# Altium schematic sheet 03 POWER.SchDoc
size 513 x 386 mm
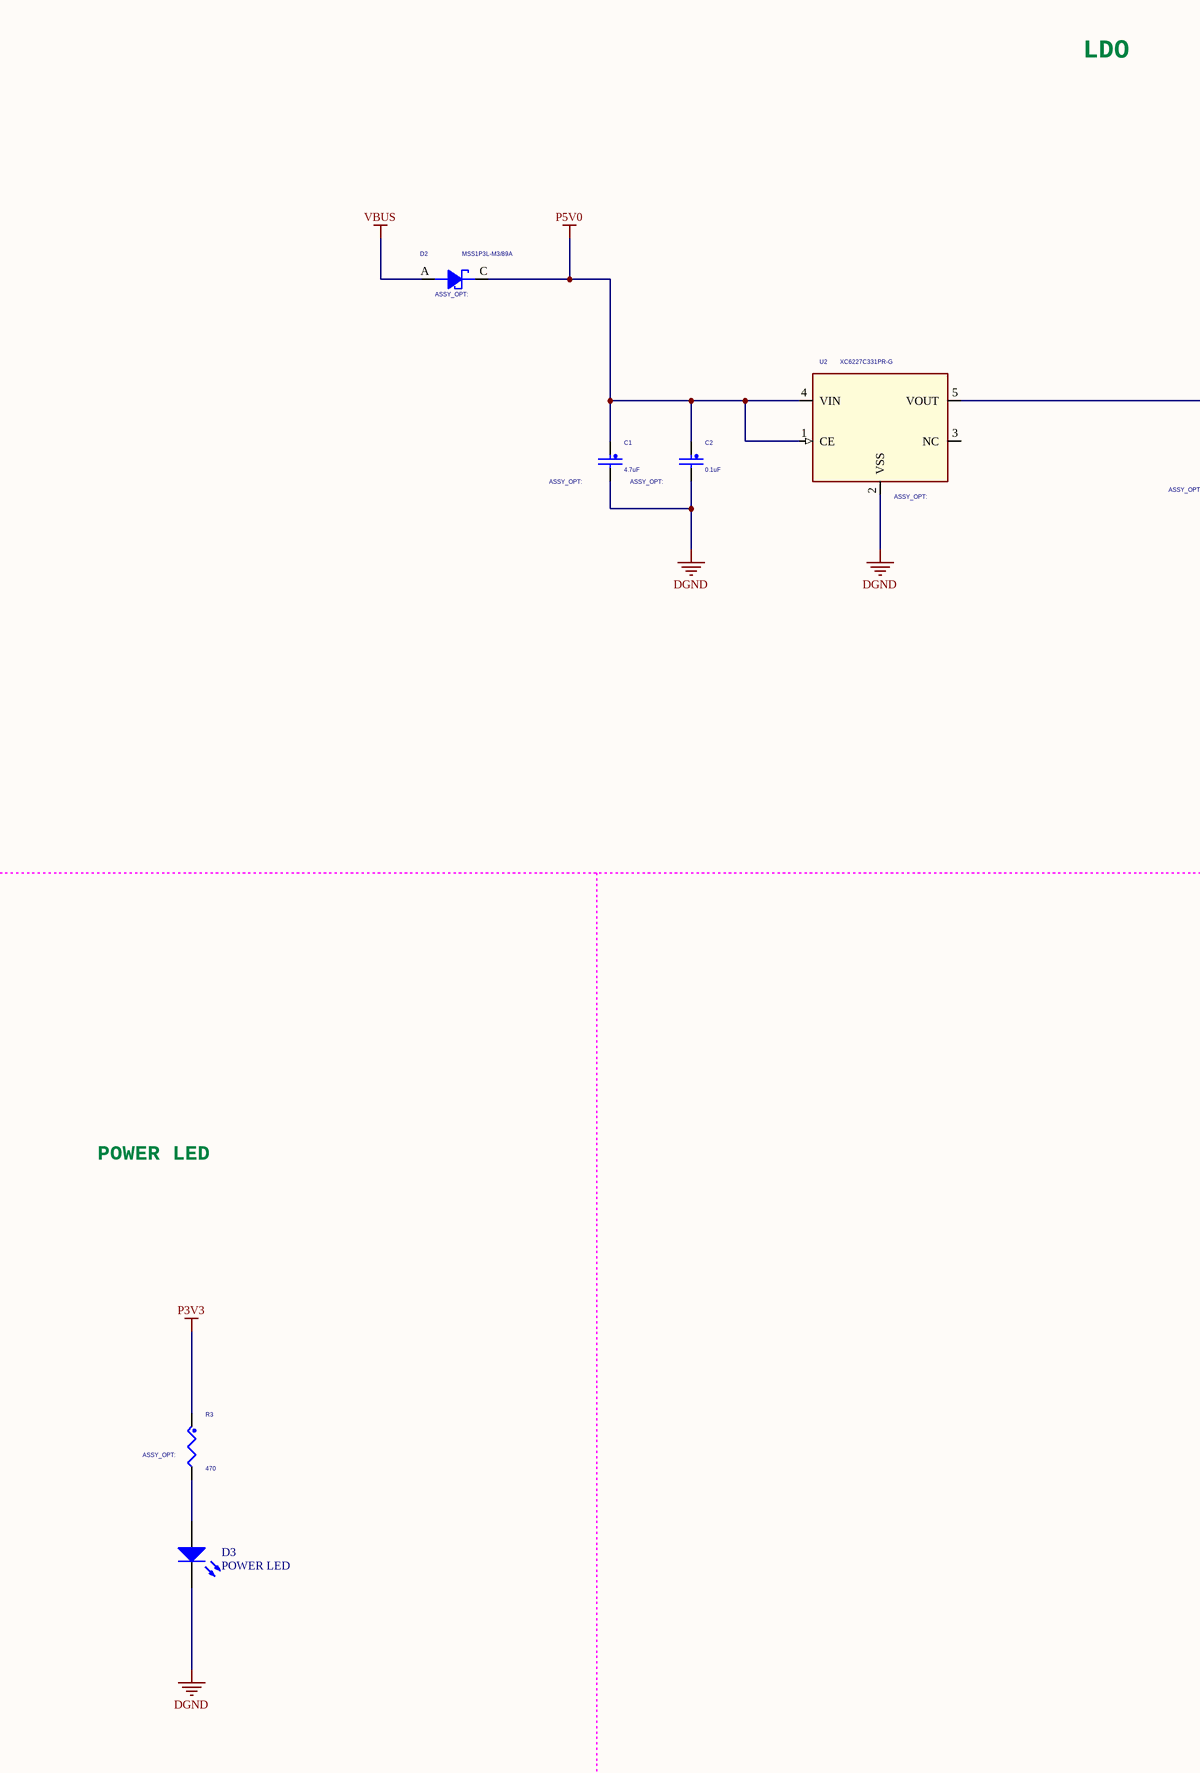
[diagram p0: 03 POWER.SchDoc, left]
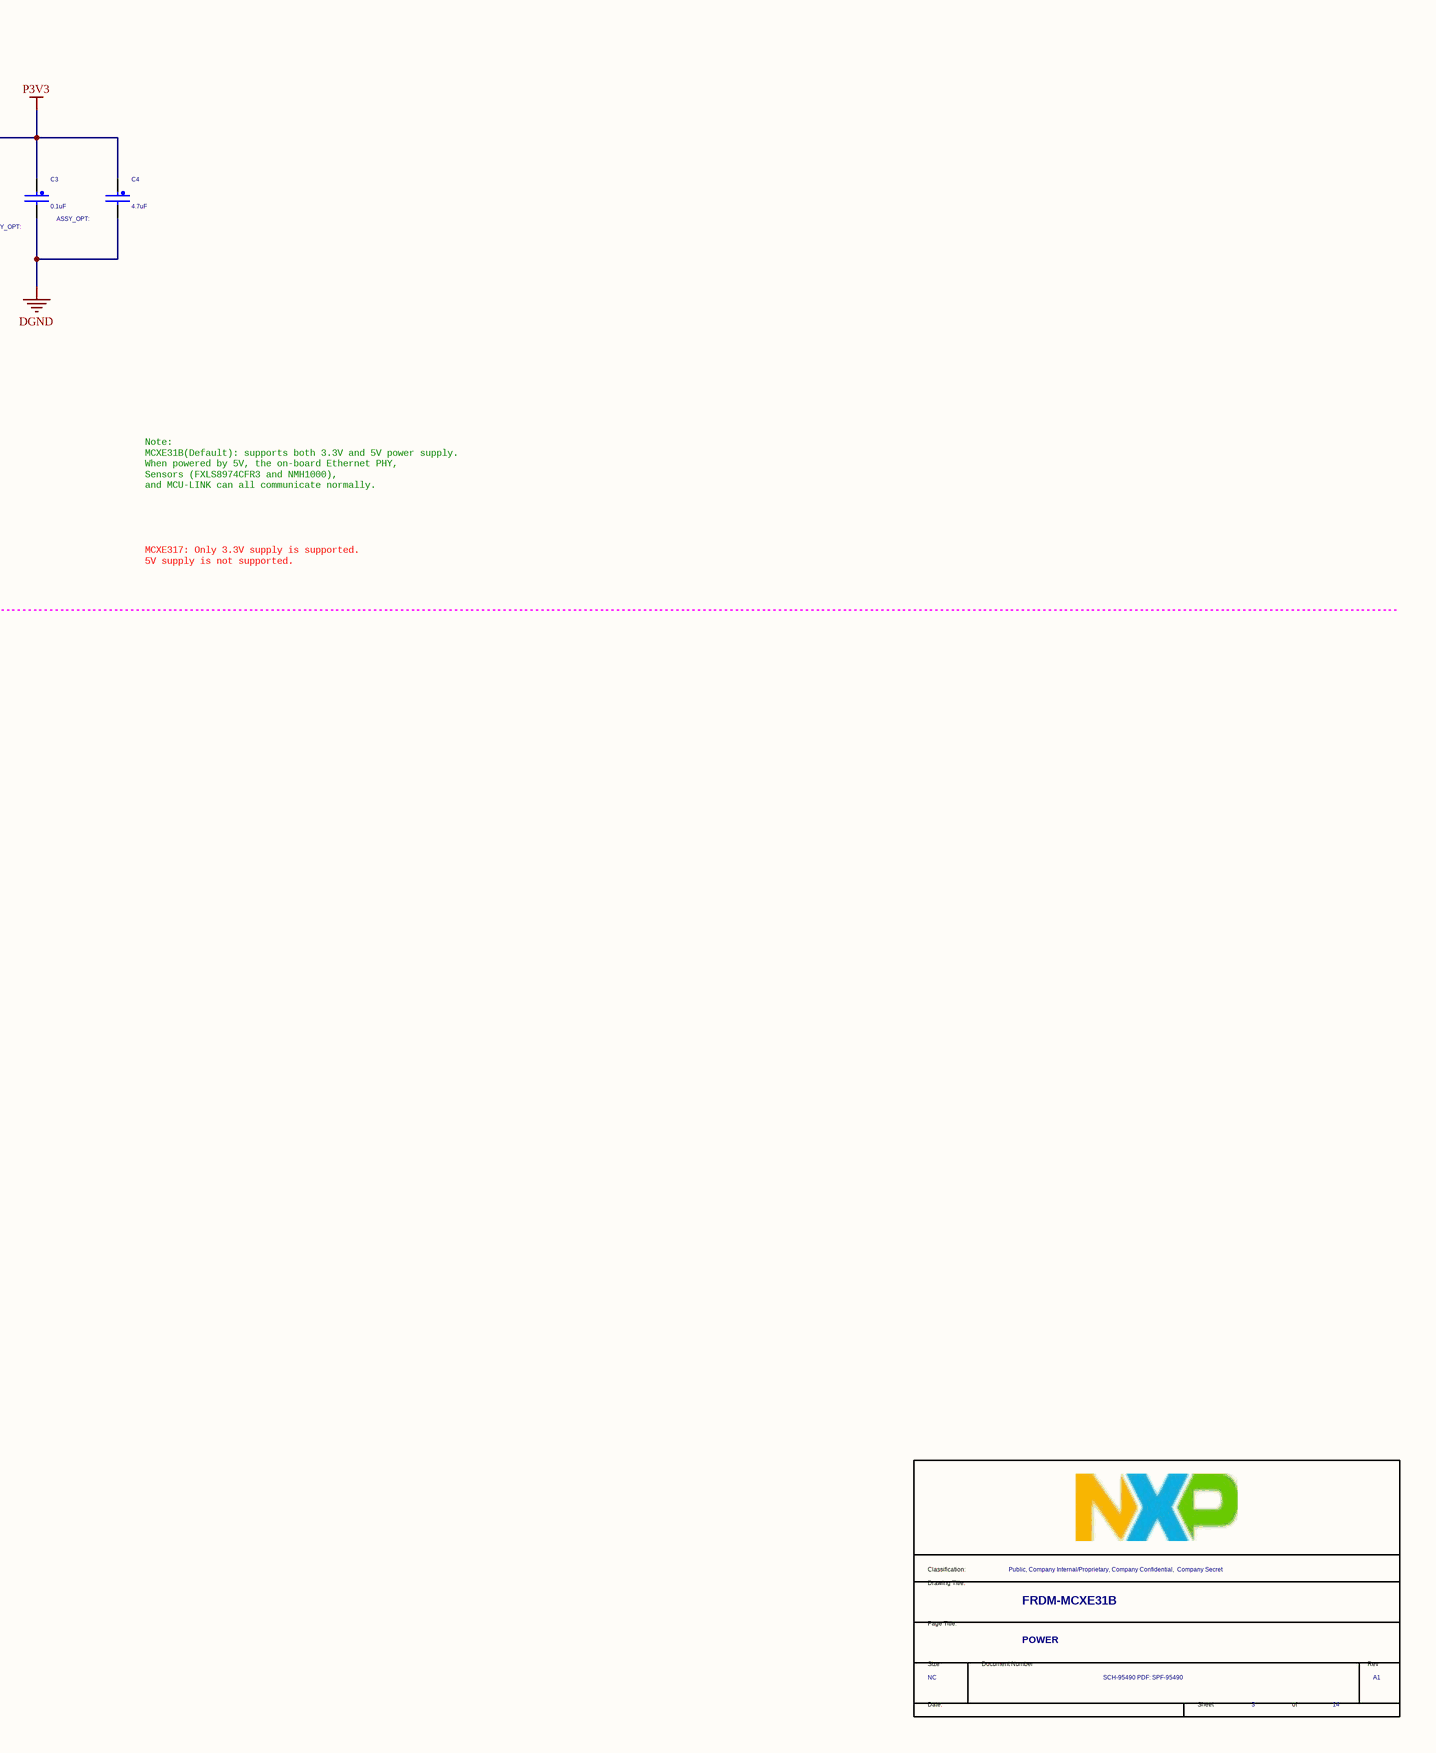
[diagram p1: 03 POWER.SchDoc, right]

## Parts
*  Title: FRDM-MCXE31B  RevCode: A1  PageTitle: POWER  Page Size: NC  Page Number: 3  Page Count: 14  Doc: SCH-95490 PDF: SPF-95490  Classification: Public, Company Internal/Proprietary, Company Confidential,  Company Secret  (hidden comment: TitleBlock_FS)  (graphical)
C1  4.7uF  [CC0603_OV]
C2  0.1uF  [CC0402_25]
C3  0.1uF  [CC0402_25]
C4  4.7uF  [CC0603_OV]
D2  MFG_PN01: MSS1P3L-M3/89A  [smb_2p7x1p4]  (hidden comment: MSS1P3L)
D3  POWER LED  [LED 0603R]
R3  470  [RC0402_25]
U2  XC6227C331PR-G  [XC6227C331PR-G]

## Nets
DGND: C1.2 C2.2 C3.2 C4.2 D3.2(K) U2.2(VSS)
P3V3: C3.1 C4.1 R3.1 U2.5(VOUT)
P5V0: C1.1 C2.1 D2.C U2.1(CE) U2.4(VIN)
VBUS: D2.A
NetD3_1: D3.1(A) R3.2

Not connected (* = marked no-connect by the designer): U2 3(NC)

## Notes on the sheet
- LDO
- Note:
  MCXE31B(Default): supports both 3.3V and 5V power supply.
  When powered by 5V, the on-board Ethernet PHY,
  Sensors (FXLS8974CFR3 and NMH1000),
  and MCU-LINK can all communicate normally.
- MCXE317: Only 3.3V supply is supported.
  5V supply is not supported.
- POWER LED
- (in symbol TitleBlock_FS) Classification:; Drawing Title:; Page Title:; Size; Document Number; Rev; Date:; Sheet; of

## Library data of the parts
* = TitleBlock_FS: OrgAddr2: Austin, TX 78735-8598; OrgAddr1: 6501 William Cannon Drive West; OrgName: NXP Semiconductors; Page Create Date: March  8, 1995
C1 C4 = CAP_NP: CAP CER 4.7uF 10V 20% X5R 0603; CLASS: DISCRETE; Temp Range: -55C TO 85C; TOL: 10%; FPLIST: CC0603_OV,CC0603,0603_CC; CAD_APPROVED: Yes; MFG_PN01: 885012106012; MFG_NAME01: WURTH ELEKTRONIK; AGILE_PN: 150-81893; ROOM: CPU; SIGNAL_MODEL: DEFAULT_CAPACITOR_220000pF_2_1; 3D_Mechanical_Footprint_File: http://fcl.am.freescale.net/ALLEGRO/step/cc0603_ov.STEP; Rated Voltage: 10V; Package Type: WCAP-CSGP_0603; Package Size: 0603; VOLTAGE: 10V; WVDC: 10V; HEIGHT: 0.87; ROHS: Yes; Tolerance: 20%
C2 = CAP_NP: CAP CER 0.1UF 16V 10% X7R 0402; CLASS: DISCRETE; MFG_PN01: CL05B104KO5NNNC; MFG_NAME01: Samsung Electro-Mechanics; Temp Range: -55C to +125C; CAD_APPROVED: Yes; FPLIST: CC0402_25,CC0402_HD,0402_CC,CAPC0402_L,cc0402_lamp3; AGILE_PN: 150-75182; 3D_Mechanical_Footprint_File: http://fcl.am.freescale.net/ALLEGRO/step/cc0402_25.STEP; ROHS: NULL; Rated Voltage: 16V; Tolerance: 10%; HEIGHT: 0.635mm
C3 = CAP_NP: CAP CER 0.1UF 16V 10% X7R 0402; CLASS: DISCRETE; Temp_Range: -55癈 to +85癈; FPLIST: CC0402_25,CC0402_HD,0402_CC,CAPC0402_L,cc0402_lamp3; CAD_APPROVED: Yes; MFG_PN01: CL05B104KO5NNNC; MFG_NAME01: Samsung Electro-Mechanics; AGILE_PN: 150-75182; SIGNAL_MODEL: DEFAULT_CAPACITOR_100000pF_2_1; Temp Range: -55C to +125C; VOLTAGE: 16V; TOL: 10%; HEIGHT: 0.635mm; ROHS: NULL; Tolerance: 10%; Rated Voltage: 16V; 3D_Mechanical_Footprint_File: http://fcl.am.freescale.net/ALLEGRO/step/cc0402_25.STEP
D2 = DIODE_SCHTKY: DIODE SCH 1A 30V MICROSMP SMT; CLASS: IC; MFG_NAME01: VISHAY INTERTECHNOLOGY; CAD_APPROVED: Yes; AGILE_PN: 480-76978; 3D_Mechanical_Footprint_File: http://fcl.am.freescale.net/ALLEGRO/step/smb_2p7x1p4.step; Rated Voltage: 30V; HEIGHT: 0.73
D3 = LED-SMT
R3 = RES: RES MF 470 OHM 1/16W 5% 0402; CLASS: DISCRETE; MFG_PN01: ERJ2GEJ471X; MFG_NAME01: PANASONIC; CAD_APPROVED: Yes; AGILE_PN: 470-30315; FPLIST: RC0402_25,RC0402_HD,0402_CC; ROHS: Yes; Tolerance: 5%; HEIGHT: 0.45
U2 = XC6227C_5P: IC VREG LDO  3.3V 0.7A 1.7-6.0V SOT-89-5; MFG_NAME01: TOREX; Temp Range: -40°C to 85°C; VOLTAGE: 1.7V ~ 6.0V; CAD_APPROVED: Yes; AGILE_PN: 315-80827; CLASS: IC; 3D_Mechanical_Footprint_File: http://fcl.am.freescale.net/ALLEGRO/step/sot89-5.STEP; MFG_PN01: XC6227C331PR-G; ROHS: NULL; HEIGHT: 1.6mm